# EAGLE board BonkSwitch (EAGLE 7.7.0)
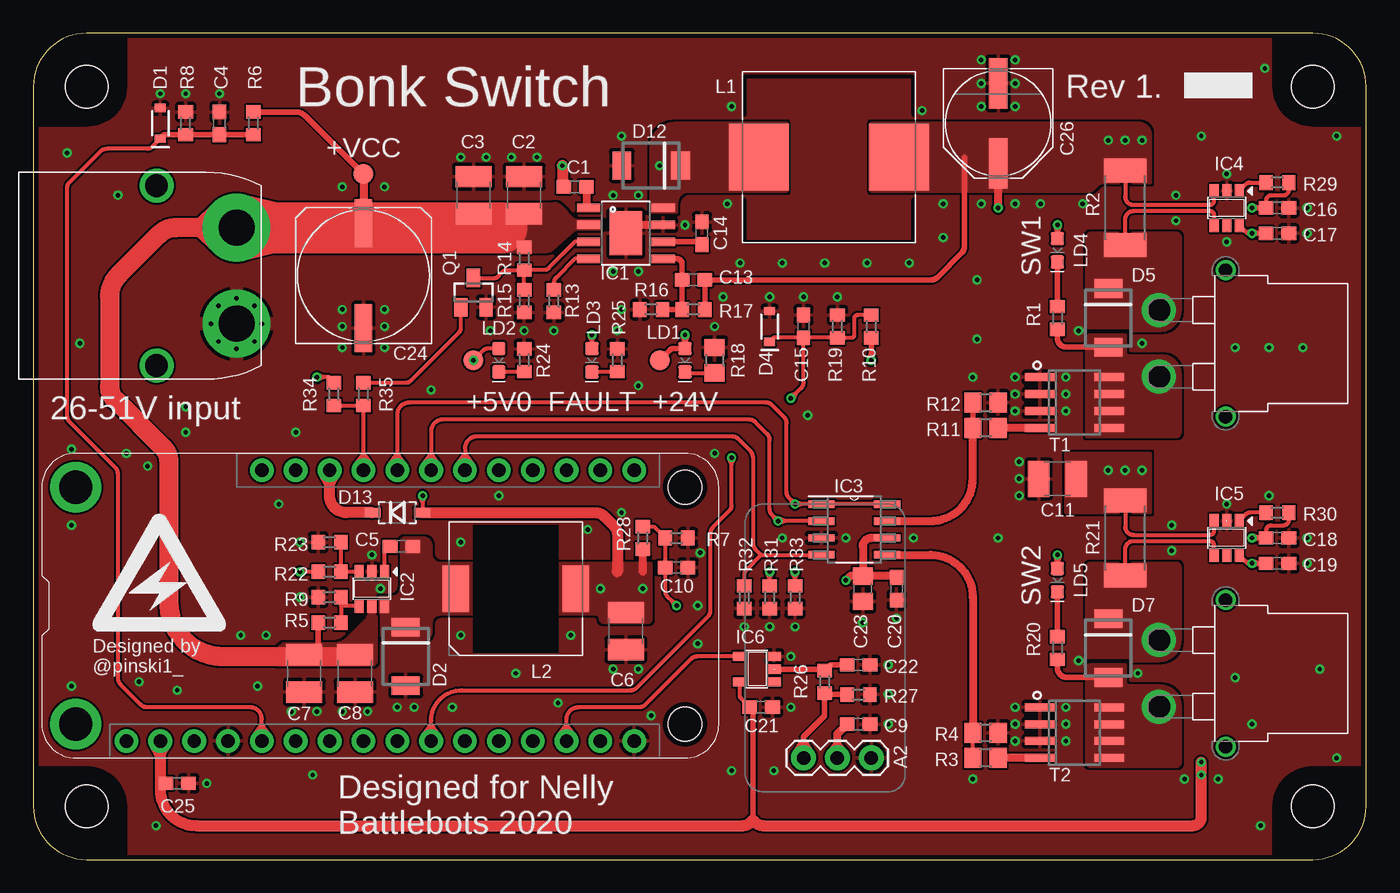
[diagram p1: board, top side]
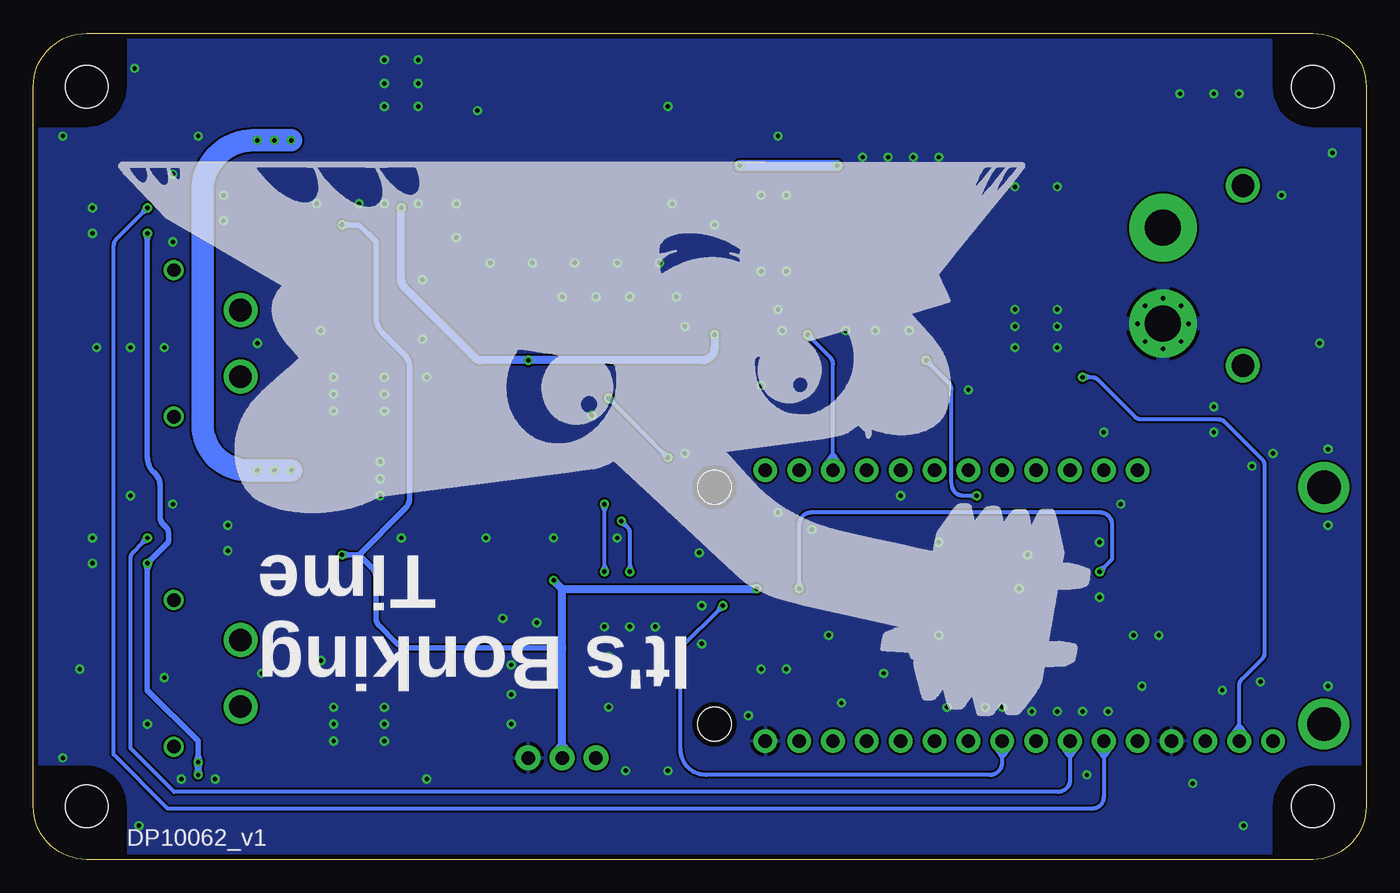
[diagram p2: board, bottom side, seen from below]

Size 100 x 62 mm. Coordinates in mm from the lower left corner, seen from the top.
Copper layers (1*16): Top 0.0356mm / dielectric 1.5011mm / Bottom 0.0356mm
Design rules "OSHPark-2layer": minimum track width 6mil, minimum drill 13mil, track to track 6mil, track to pad 6mil, pad to pad 6mil, via to via 6mil, smd to smd 6mil, copper to edge 15mil, drill to drill 6mil, minimum pad ring 7mil, minimum via ring 7mil, stop-mask expansion 3mil, vias tented up to drill 15mil, thermal gap 10mil
Net classes: 0 default: width 0.152 mm, drill 0.33 mm; 1 power: width 0.508 mm, drill 0.33 mm, clearance 0.305 mm
tRestrict: 6 lines

## Footprints (pad centres in the part's own frame; a part is rotated, then mirrored left to right if it is on the bottom)
FEATHERWING_DIM = drill 1 pad 1.778: 1 6.35,1.27; 2 8.89,1.27; 3 11.43,1.27; 4 13.97,1.27; 5 16.51,1.27; 6 19.05,1.27; 7 21.59,1.27; 8 24.13,1.27; 9 26.67,1.27; 10 29.21,1.27; 11 31.75,1.27; 12 34.29,1.27; 13 36.83,1.27; 14 39.37,1.27; 15 41.91,1.27; 16 44.45,1.27; 17 44.45,21.59; 18 41.91,21.59; 19 39.37,21.59; 20 36.83,21.59; 21 34.29,21.59; 22 31.75,21.59; 23 29.21,21.59; 24 26.67,21.59; 25 24.13,21.59; 26 21.59,21.59; 27 19.05,21.59; 28 16.51,21.59 | drill 2.5 pad 3.81: P$1 2.54,20.32; P$2 2.54,2.54 | hole 2.54: 48.26,20.32; 48.26,2.54
FRSKY_XM+ = drill 1.016 pad 1.88: 1 0,0; 2 0,2.54; 3 0,5.08
C0603 = smd 1.1 x 1: 1 -0.85,0; 2 0.85,0
C1210 = smd 1.6 x 2.7: 1 -1.4,0; 2 1.4,0
C0805 = smd 1.3 x 1.5: 1 -0.95,0; 2 0.95,0
UD-10X10_NICHICON = smd 3.6 x 1.3: + 3.925,0; - -3.95,0
PANASONIC_E = smd 3.8 x 1.4: + 3,0; - -3,0
SOD-323 = smd 0.63 x 0.83: A 1.15,0; C -1.15,0
SOD128 = smd 1.4 x 2.1: A 2.2,0; C -2.2,0
SOD-123 = smd 1.2 x 0.7: A 1.85,0; C -1.85,0
HSOIC8 = smd 0.65 x 1.75: 1 -1.905,-2.8; 2 -0.635,-2.8; 3 0.635,-2.8; 4 1.905,-2.8; 5 1.905,2.8; 6 0.635,2.8; 7 -0.635,2.8; 8 -1.905,2.8 | smd 3.3 x 2.41: EP 0,0
SOT23-6 = smd 0.69 x 0.99: 1 -0.95,-1.29; 2 0,-1.29; 3 0.95,-1.29; 4 0.95,1.3; 5 0,1.3; 6 -0.95,1.3
SOIC127P600X175-8N = smd 1.981 x 0.559: 1 -2.464,1.905; 2 -2.464,0.635; 3 -2.464,-0.635; 4 -2.464,-1.905; 5 2.464,-1.905; 6 2.464,-0.635; 7 2.464,0.635; 8 2.464,1.905
SOT23-5 = smd 0.69 x 0.99: 1 -0.95,-1.29; 2 0,-1.29; 3 0.95,-1.29; 4 0.95,1.3; 5 -0.95,1.3
WE-HCI_1350/1365 = smd 4.5 x 5: 1 -5.25,0; 2 5.25,0
WE-PD_1030/1050 = smd 2 x 3.5: 1 -4.5,0; 2 4.5,0
LED-0603 = smd 1 x 1: A -0.877,0; C 0.877,0
DP10062_V1 = hole 3.2: 4,4; 96,4; 96,58; 4,58
SOT23 = smd 1 x 1.4: 1 -0.95,-1.1; 2 0.95,-1.1; 3 0,1.1
R0603 = smd 1 x 1.1: 1 -0.85,0; 2 0.85,0
R2512 = smd 1.8 x 3.2: 1 -2.8,0; 2 2.8,0
R0805 = smd 1.3 x 1.5: 1 -0.95,0; 2 0.95,0
SHORT_TOP-01 = smd 0.025 x 0.025: 1 0,0; 2 0,0
SO-08 = smd 0.6 x 2.2: 1 -1.905,-2.6; 2 -0.635,-2.6; 3 0.635,-2.6; 4 1.905,-2.6; 5 1.905,2.6; 6 0.635,2.6; 7 -0.635,2.6; 8 -1.905,2.6
TESTPAD_1.5X1.5 = smd 1.5 x 1.5: 1 0,0
XT60PW-M = drill 1.7: 3 6.75,6; 4 -6.75,6 | drill 2.7 pad 5.08: + 3.6,0; - -3.6,0
XT30PW-F = drill 1.7: + -2.5,0; - 2.5,0 | drill 1: P$3 5.5,5; P$4 -5.5,5

## Placement (x,y rotation side)
A1  FEATHERWING_NODIM  [FEATHERWING_DIM]  0.64,7.62 0 top
A2  FRSKY_XM+  [FRSKY_XM+]  62.87,7.62 90 top
C1  100nF  [C0603]  40.64,50.48 180 top
C2  2.2uF 100V  [C1210]  36.83,49.85 90 top
C3  2.2uF 100V  [C1210]  33.02,49.85 90 top
C4  10nF  [C0603]  13.97,55.24 90 top
C5  100nF  [C0603]  27.62,23.5 0 top
C6  10uF 35V  [C1210]  44.45,17.14 270 top
C7  2.2uF 100V  [C1210]  20.32,13.97 270 top
C8  2.2uF 100V  [C1210]  24.13,13.97 270 top
C9  100nF  [C0603]  61.91,10.16 0 top
C10  10nF  [C0603]  48.26,21.91 0 top
C11  10uF 35V  [C1210]  76.83,28.57 180 top
C13  470pF  [C0603]  49.53,43.5 180 top
C14  10nF  [C0603]  50.16,46.99 90 top
C15  10nF  [C0603]  57.78,40.01 90 top
C16  100nF  [C0603]  93.34,48.9 0 top
C17  100nF  [C0603]  93.34,46.99 0 top
C18  100nF  [C0603]  93.34,24.13 0 top
C19  100nF  [C0603]  93.34,22.23 0 top
C20  100nF  [C0603]  64.77,20.32 270 top
C21  100nF  [C0603]  54.61,11.43 0 top
C22  100pF  [C0603]  61.91,14.61 0 top
C23  1uF  [C0805]  62.23,20.32 270 top
C24  47uF 100V  [UD-10X10_NICHICON]  24.77,43.81 90 top
C25  100nF  [C0603]  10.79,5.71 0 top
C26  120uF 35V  [PANASONIC_E]  72.39,55.24 270 top
D1  5.6V  [SOD-323]  9.53,55.24 90 top
D2  PMEG10030ELPX  [SOD128]  27.94,15.24 270 top
D4  5.6V  [SOD-323]  55.24,40.01 90 top
D5  PMEG10030ELPX  [SOD128]  80.64,40.64 270 top
D7  PMEG10030ELPX  [SOD128]  80.64,15.88 270 top
D12  PMEG10030ELPX  [SOD128]  46.35,52.07 180 top
D13  MBR130  [SOD-123]  27.3,26.04 0 top
IC1  LMR16030SDDAR  [HSOIC8]  44.45,46.99 270 top
IC2  LMR16006XDDC  [SOT23-6]  25.4,20.32 180 top
IC3  FAN3227TMX  [SOIC127P600X175-8N]  61.59,24.77 0 top
IC4  LMP8640MK-T  [SOT23-6]  89.53,48.9 180 top
IC5  LMP8640MK-T  [SOT23-6]  89.53,24.13 180 top
IC6  74LVC1G14DBV  [SOT23-5]  54.29,14.29 90 top
L1  7443551221  [WE-HCI_1350/1365]  59.69,52.7 0 top
L2  7447714470  [WE-PD_1030/1050]  36.2,20.32 0 top
LD1  GREEN  [LED-0603]  48.9,37.47 270 top
LD2  GREEN  [LED-0603]  34.92,37.47 270 top
LD3  RED  [LED-0603]  41.91,37.47 270 top
LD4  Yellow  [LED-0603]  76.83,45.72 270 top
LD5  Yellow  [LED-0603]  76.83,20.95 270 top
LG1  [LOGO_10X10]  4.45,17.14 0 top
PCB1  PCB_DP_RECTANGLE-100X62  [DP10062_V1]  0,0 0 top
Q1  SI2302CDS  [SOT23]  33.02,42.55 0 top
R1  2k2  [R0603]  76.83,40.64 90 top
R2  0R01  [R2512]  81.92,48.9 90 top
R3  10R  [R0805]  71.44,7.62 180 top
R4  39k  [R0805]  71.44,9.53 0 top
R5  82k  [R0603]  22.23,17.78 180 top
R6  470k  [R0603]  16.51,55.24 90 top
R7  33k  [R0603]  48.26,24.13 180 top
R8  30k  [R0603]  11.43,55.24 270 top
R9  4k3  [R0603]  22.23,19.68 0 top
R10  470k  [R0603]  62.87,40.01 270 top
R11  10R  [R0805]  71.44,32.38 180 top
R12  39k  [R0805]  71.44,34.29 0 top
R13  47k  [R0603]  39.05,41.91 90 top
R14  130k  [R0603]  36.83,45.09 90 top
R15  20k  [R0603]  36.83,41.91 90 top
R16  20k  [R0603]  46.35,41.27 0 top
R17  620k  [R0603]  49.53,41.27 0 top
R18  2k2  [R0805]  51.12,37.47 270 top
R19  56k  [R0603]  60.33,40.01 270 top
R20  2k2  [R0603]  76.83,15.88 90 top
R21  0R01  [R2512]  81.92,24.13 90 top
R22  68k  [R0603]  22.23,21.59 180 top
R23  11k  [R0603]  22.23,23.81 0 top
R24  2k2  [R0603]  36.83,37.47 270 top
R25  2k2  [R0603]  43.81,37.47 270 top
R26  100R  [R0603]  59.37,13.34 90 top
R27  10k  [R0603]  61.91,12.38 180 top
R28  47k  [R0603]  45.72,24.13 270 top
R29  100R  [R0603]  93.34,50.8 180 top
R30  100R  [R0603]  93.34,26.04 180 top
R31  10k  [R0603]  55.24,19.68 270 top
R32  10k  [R0603]  53.34,19.68 270 top
R33  10k  [R0603]  57.15,19.68 270 top
R34  10k  [R0603]  22.54,34.92 270 top
R35  100R  [R0603]  24.77,34.92 270 top
SH1  SHORTT1  [SHORT_TOP-01]  81.92,51.12 0 top
SH2  SHORTT1  [SHORT_TOP-01]  81.92,46.67 0 top
SH3  SHORTT1  [SHORT_TOP-01]  81.92,26.35 0 top
SH4  SHORTT1  [SHORT_TOP-01]  81.92,21.91 0 top
T1  IRF7493TRPBF  [SO-08]  78.11,34.29 270 top
T2  IRF7493TRPBF  [SO-08]  78.11,9.53 270 top
TP1  TESTPOINT_1.5X1.5  [TESTPAD_1.5X1.5]  46.99,37.47 0 top
TP2  TESTPOINT_1.5X1.5  [TESTPAD_1.5X1.5]  33.02,37.47 0 top
TP3  TESTPOINT_1.5X1.5  [TESTPAD_1.5X1.5]  24.77,51.44 0 top
X1  XT60PW-M  [XT60PW-M]  15.24,43.81 90 top
X2  XT30PW-F  [XT30PW-F]  84.45,38.73 270 top
X3  XT30PW-F  [XT30PW-F]  84.45,13.97 270 top

## Tracks (layer width: path | path; a pad name or v marks a point on that pad's centre or on a via)
5V_MON  (via drill 0.33)
  Top 0.305: R28.1 46.56,24.98 R7.2 C10.1 47.41,20.09 arc45 47.55,19.76 47.91,19.4 | 47.91,19.4 v48.26,19.05 | 47.91,19.4 48.08,18.98 v48.26,19.05 | 47.91,19.4 48.33,19.23 v48.26,19.05
  Bottom 0.305: A1.9 27.3,7.89 27.3,7.3 arc90 28.26,6.35 49.53,6.35 arc90 51.44,8.26 51.44,15.61 arc45 51.25,16.06 48.61,18.7 | 48.61,18.7 v48.26,19.05 | 48.61,18.7 48.44,19.12 v48.26,19.05 | 48.61,18.7 48.19,18.87 v48.26,19.05
  Bottom 0.61: 27.3,7.89 27.78,8.55 A1.9 26.83,8.55 27.3,7.89
24V_MON  (via drill 0.33)
  Top 0.305: A1.10 29.84,9.89 | 29.84,9.89 | 29.84,9.89 29.84,10.41 arc-90 32.13,12.7 44.82,12.7 arc45 45.27,12.89 50.61,18.23 arc45 50.8,18.68 50.8,24.39 arc-45 51.06,25.03 52.26,26.22 arc45 52.39,26.54 52.39,29.67 | 52.39,29.67 | 52.39,29.67 v52.39,30.16 | C15.1 R19.2 61.38,39.16 arc90 61.59,39.37 61.59,40.64 arc-90 61.81,40.85 R10.1 | C15.1 55.55,39.16 D4.C | v56.83,34.61 57.18,34.96 | 57.18,34.96 57.6,35.37 arc45 57.78,35.82 C15.1 | 52.39,29.67 52.56,30.09 | 52.39,29.67 52.21,30.09 | 52.56,30.09 | 52.21,30.09 | v52.39,30.16 52.21,30.09 | 52.39,29.67 52.56,30.09 | 52.39,29.67 | 52.39,29.67 52.21,30.09 | 52.39,29.67 52.56,30.09 | v52.39,30.16 52.56,30.09 | 52.39,29.67 52.21,30.09 | v52.39,30.16 52.21,30.09 | 52.39,29.67 52.56,30.09 | v52.39,30.16 52.56,30.09 | 52.39,29.67 52.21,30.09 | v52.39,30.16 52.21,30.09 | 57.18,34.96 56.76,34.78 v56.83,34.61 | 57.18,34.96 57.01,34.53 v56.83,34.61
  Top 0.61: 29.84,9.89 | 29.84,9.89 29.37,9.23 | 29.84,9.89 29.37,9.23 | 29.84,9.89 30.32,9.23 | A1.10 30.32,9.23 | 29.84,9.89 29.37,9.23 | A1.10 29.37,9.23 | 29.84,9.89 30.32,9.23 | 29.84,9.89 29.37,9.23 | A1.10 29.37,9.23 | 29.84,9.89 30.32,9.23 | A1.10 30.32,9.23 | 29.84,9.89 29.37,9.23 | A1.10 29.37,9.23 | 29.84,9.89 30.32,9.23 | A1.10 30.32,9.23
  Bottom 0.305: v52.39,30.16 52.74,30.51 | 52.74,30.51 56.48,34.26 | 56.48,34.26 v56.83,34.61 | 52.74,30.51 52.31,30.34 v52.39,30.16 | 52.74,30.51 52.56,30.09 v52.39,30.16 | 56.48,34.26 56.91,34.43 v56.83,34.61 | 56.48,34.26 56.66,34.68 v56.83,34.61
!SBUS
  Top 0.406: R27.2 59.48,12.38 R26.1 59.37,10.79 57.78,9.21 57.78,8.64 A2.3
  Top 0.813: 57.78,8.64 57.33,7.9 A2.3 58.24,7.9 57.78,8.64
!SBUS_FILT
  Top 0.406: C22.1 59.79,14.61 R26.2 59.27,14.29 IC6.2
+3V3  (via drill 0.33)
  Top 0.305: v91.44,22.23 91.09,22.23 90.96,22.35 | v91.44,22.23 91.94,22.23 | 91.94,22.23 | 91.94,22.23 C19.1 | 90.96,22.35 IC5.6 | v91.44,46.99 91.09,46.99 90.96,47.12 | v91.44,46.99 91.94,46.99 | 91.94,46.99 | 91.94,46.99 C17.1 | IC4.6 90.96,47.12 | R34.1 22.23,36.2 21.77,36.2 | 21.77,36.2 | 21.77,36.2 v21.27,36.2 | IC6.5 52.99,12.35 arc45 53.1,12.09 C21.1 | 21.77,36.2 21.35,36.37 | 21.77,36.2 21.35,36.02 | 21.35,36.37 | 21.35,36.02 | v21.27,36.2 21.35,36.02 | 91.94,46.99 91.51,47.17 | 91.94,46.99 91.51,46.81 | 91.51,47.17 | 91.51,46.81 | v91.44,46.99 91.51,46.81 | 91.94,22.23 91.51,22.4 | 91.94,22.23 91.51,22.05 | 91.51,22.4 | 91.51,22.05 | v91.44,22.23 91.51,22.05 | 21.77,36.2 21.35,36.37 | 21.77,36.2 | 21.77,36.2 21.35,36.02 | 21.77,36.2 21.35,36.37 | v21.27,36.2 21.35,36.37 | 21.77,36.2 21.35,36.02 | v21.27,36.2 21.35,36.02 | 21.77,36.2 21.35,36.37 | v21.27,36.2 21.35,36.37 | 21.77,36.2 21.35,36.02 | v21.27,36.2 21.35,36.02 | 91.94,46.99 91.51,47.17 | 91.94,46.99 | 91.94,46.99 91.51,46.81 | 91.94,46.99 91.51,47.17 | v91.44,46.99 91.51,47.17 | 91.94,46.99 91.51,46.81 | v91.44,46.99 91.51,46.81 | 91.94,46.99 91.51,47.17 | v91.44,46.99 91.51,47.17 | 91.94,46.99 91.51,46.81 | v91.44,46.99 91.51,46.81 | 90.96,47.12 91.32,46.84 v91.44,46.99 | 90.96,47.12 91.42,47.18 v91.44,46.99 | 91.94,22.23 91.51,22.4 | 91.94,22.23 | 91.94,22.23 91.51,22.05 | 91.94,22.23 91.51,22.4 | v91.44,22.23 91.51,22.4 | 91.94,22.23 91.51,22.05 | v91.44,22.23 91.51,22.05 | 91.94,22.23 91.51,22.4 | v91.44,22.23 91.51,22.4 | 91.94,22.23 91.51,22.05 | v91.44,22.23 91.51,22.05 | 90.96,22.35 91.32,22.07 v91.44,22.23 | 90.96,22.35 91.42,22.41 v91.44,22.23
  Top 0.406: C21.1 53.98,11.43 53.98,2.97
  Top 0.813: A1.2 9.53,7.89 | 9.53,7.89 9.53,5.71 | 9.53,5.71 9.53,5.23 arc90 12.22,2.54 53.27,2.54 arc45 53.74,2.73 53.98,2.97 54.16,2.79 arc45 54.75,2.54 87,2.54 arc90 87.63,3.17 v87.63,6.35 v87.63,7.3 | C25.1 9.53,5.71 | 9.53,7.89 9.95,8.66 A1.2 | 9.53,7.89 9.1,8.66 A1.2
  Bottom 0.305: A1.2 9.53,9.89 | 9.53,9.89 | 9.53,9.89 9.53,13.07 arc45 9.34,13.52 7.81,15.05 arc-45 7.62,15.5 7.62,29.58 arc-45 7.81,30.03 10.61,32.83 arc-45 11.06,33.02 16.88,33.02 arc45 17.33,33.21 20.13,36.01 arc-45 20.58,36.2 20.78,36.2 | v21.27,36.2 20.78,36.2 | 20.78,36.2 | 20.78,36.2 21.2,36.02 | 21.2,36.02 | v21.27,36.2 21.2,36.02 | 20.78,36.2 21.2,36.37 | 20.78,36.2 21.2,36.02 | 20.78,36.2 | 20.78,36.2 21.2,36.02 | v21.27,36.2 21.2,36.02 | 20.78,36.2 21.2,36.37 | 21.2,36.37 | v21.27,36.2 21.2,36.37 | 20.78,36.2 21.2,36.02 | 20.78,36.2 21.2,36.37 | 20.78,36.2 21.2,36.02 | v21.27,36.2 21.2,36.02 | 20.78,36.2 21.2,36.37 | v21.27,36.2 21.2,36.37
  Bottom 0.406: 91.44,46.49 91.44,30.18 arc-45 90.97,29.06 90.87,28.96 arc45 90.49,28.03 90.49,25.69 arc-45 90.28,25.19 90.06,24.97 arc45 89.85,24.47 89.85,24 arc45 89.98,23.68 91.09,22.57 | 91.44,46.49 | 91.44,46.49 v91.44,46.99 | 91.09,22.57 v91.44,22.23 | v91.44,22.23 91.44,21.73 | 91.44,21.73 | 91.44,21.73 91.44,12.7 87.63,8.89 87.63,7.8 | 87.63,7.8 | 87.63,7.8 v87.63,7.3 | v87.63,7.3 87.63,6.84 | 87.63,6.84 | 87.63,6.84 87.63,6.81 | 87.63,6.81 | 87.63,6.81 v87.63,6.35 | 91.44,46.49 91.57,46.95 | 91.44,46.49 91.57,46.95 | 91.57,46.95 | 91.57,46.95 | 91.44,46.49 91.31,46.95 | 91.31,46.95 | v91.44,46.99 91.31,46.95 | 91.57,46.95 | v91.44,46.99 91.57,46.95 | 91.31,46.95 | 91.44,21.73 91.57,22.19 | 91.44,21.73 91.57,22.19 | 91.57,22.19 | 91.57,22.19 | 91.44,21.73 91.31,22.19 | 91.31,22.19 | v91.44,22.23 91.31,22.19 | 91.57,22.19 | v91.44,22.23 91.57,22.19 | 91.31,22.19 | 87.63,7.8 87.76,7.34 | 87.63,6.81 87.64,6.84 | 87.5,7.34 | 87.76,7.34 | v87.63,7.3 87.76,7.34 | 87.63,7.8 87.5,7.34 | 87.5,7.34 | v87.63,7.3 87.5,7.34 | 87.63,7.8 87.76,7.34 | 87.76,7.34 | v87.63,7.3 87.76,7.34 | 87.63,6.81 87.76,7.26 | 87.76,7.26 | 87.76,7.26 | 87.63,6.81 87.62,6.84 | 87.5,7.26 | v87.63,7.3 87.5,7.26 | 87.76,7.26 | v87.63,7.3 87.76,7.26 | 87.5,7.26 | 87.64,6.84 87.65,6.81 | 87.65,6.81 87.77,6.39 | 87.62,6.84 87.61,6.81 | 87.61,6.81 87.5,6.39 | 87.62,6.84 87.63,6.81 | 87.63,6.81 87.76,6.39 | 87.63,6.84 87.62,6.81 | 87.62,6.81 87.5,6.39 | 87.5,6.39 | 87.5,6.39 | 87.63,6.84 87.64,6.81 | 87.64,6.81 87.76,6.39 | 87.76,6.39 | v87.63,6.35 87.76,6.39 | 87.63,6.84 87.62,6.81 | 87.62,6.81 87.5,6.39 | 87.5,6.39 | v87.63,6.35 87.5,6.39 | 87.63,6.84 87.64,6.81 | 87.64,6.81 87.76,6.39 | 87.76,6.39 | v87.63,6.35 87.76,6.39 | 91.44,46.49 91.57,46.95
  Bottom 0.406: 91.44,46.49 | 91.44,46.49 91.31,46.95 | 91.31,46.95 | 91.44,46.49 91.57,46.95 | 91.57,46.95 | 91.44,46.49 91.31,46.95 | v91.44,46.99 91.31,46.95 | 91.44,46.49 91.57,46.95 | v91.44,46.99 91.57,46.95 | 91.44,46.49 91.31,46.95 | v91.44,46.99 91.31,46.95 | 91.44,21.73 91.57,22.19 | 91.09,22.57 91.32,22.16 v91.44,22.23 | 91.09,22.57 91.51,22.35 v91.44,22.23 | 91.44,21.73 | 91.44,21.73 91.31,22.19 | 91.31,22.19 | 91.44,21.73 91.57,22.19 | 91.57,22.19 | 91.44,21.73 91.31,22.19 | v91.44,22.23 91.31,22.19 | 91.44,21.73 91.57,22.19 | v91.44,22.23 91.57,22.19 | 91.44,21.73 91.31,22.19 | v91.44,22.23 91.31,22.19 | 87.63,7.8 87.76,7.34 | 87.63,6.81 87.76,7.26 | 87.5,7.34 | 87.63,7.8 | 87.63,7.8 87.5,7.34 | 87.5,7.34 | v87.63,7.3 87.5,7.34 | 87.63,7.8 87.76,7.34 | 87.63,7.8 87.5,7.34 | v87.63,7.3 87.5,7.34 | 87.63,7.8 87.76,7.34 | 87.76,7.34 | 87.63,7.8 87.5,7.34 | v87.63,7.3 87.5,7.34 | 87.63,7.8 87.76,7.34 | v87.63,7.3 87.76,7.34 | 87.63,6.81 | 87.5,7.26 | 87.5,7.26 | 87.63,6.81 87.76,7.26 | 87.76,7.26 | 87.76,7.26 | 87.63,6.81 87.62,6.84 | 87.62,6.84 87.5,7.26 | v87.63,7.3 87.5,7.26 | 87.63,6.81 87.64,6.84 | 87.64,6.84 87.76,7.26 | v87.63,7.3 87.76,7.26 | 87.63,6.81 87.62,6.84 | 87.62,6.84 87.5,7.26 | 87.5,7.26 | v87.63,7.3 87.5,7.26 | 87.76,7.26 87.63,6.81 87.5,7.26 | v87.63,7.3 87.76,7.26 | v87.63,7.3 87.5,7.26 | 87.65,6.81 87.77,7.27 v87.63,7.3 | 87.65,6.81 87.5,7.26 v87.63,7.3 | 87.61,6.81 87.76,7.26 v87.63,7.3 | 87.61,6.81 87.49,7.27 v87.63,7.3 | 87.63,6.81 87.76,7.26 | v87.63,7.3 87.76,7.26 | 87.63,6.81 87.5,7.26 | v87.63,7.3 87.5,7.26 | 87.62,6.81 87.76,7.26 | 87.62,6.81 87.61,6.84 | 87.5,7.27 | v87.63,7.3 87.5,7.27 | 87.64,6.81 87.65,6.84 | 87.64,6.81 87.63,6.84 | 87.63,6.84 87.5,7.26 | 87.62,6.81 87.63,6.84
  Bottom 0.406: 87.63,6.84 87.76,7.26 | v87.63,7.3 87.76,7.26 | 87.62,6.81 87.61,6.84 | 87.61,6.84 87.5,7.27 | v87.63,7.3 87.5,7.27 | 87.64,6.81 87.65,6.84 | 87.65,6.84 87.77,7.27 v87.63,7.3 | 87.64,6.81 87.5,7.26 | v87.63,7.3 87.5,7.26 | 87.63,6.84 87.76,6.39 | 87.63,6.84 87.76,6.39 | 87.62,6.84 87.5,6.39 | 87.5,6.39 | v87.63,6.35 87.5,6.39 | 87.62,6.84 87.76,6.39 | 87.63,6.84 87.5,6.39 | v87.63,6.35 87.5,6.39 | 87.63,6.84 87.76,6.39 | 87.76,6.39 | 87.76,6.39 | v87.63,6.35 87.76,6.39 | 87.61,6.84 87.49,6.38 v87.63,6.35 | 87.61,6.84 87.76,6.39 v87.63,6.35 | 87.65,6.84 87.5,6.39 v87.63,6.35 | 87.65,6.84 87.77,6.38 v87.63,6.35 | 87.63,6.84 87.5,6.39 | 87.5,6.39 | v87.63,6.35 87.5,6.39 | 87.63,6.84 87.76,6.39 | v87.63,6.35 87.76,6.39 | 87.5,6.39 | 87.63,6.84 | 87.64,6.84 87.5,6.39 v87.63,6.35 | 87.64,6.84 87.77,6.39 | v87.63,6.35 87.77,6.39 | 87.62,6.84 87.5,6.39 | v87.63,6.35 87.5,6.39 | 87.62,6.84 87.76,6.39 | v87.63,6.35 87.76,6.39 | 87.63,6.84 87.5,6.39 | 87.5,6.39 | v87.63,6.35 87.5,6.39 | 87.63,6.84 87.76,6.39 | 87.63,6.84 87.5,6.39 | v87.63,6.35 87.5,6.39 | 87.63,6.84 87.76,6.39 | 87.76,6.39 | 87.63,6.84 87.5,6.39 | v87.63,6.35 87.5,6.39 | 87.63,6.84 87.76,6.39 | v87.63,6.35 87.76,6.39
  Bottom 0.61: 9.53,9.89 | 9.53,9.89 9.05,9.23 | 9.53,9.89 9.05,9.23 | 9.53,9.89 10,9.23 | A1.2 10,9.23 | 9.53,9.89 9.05,9.23 | A1.2 9.05,9.23 | 9.53,9.89 10,9.23 | 9.53,9.89 9.05,9.23 | A1.2 9.05,9.23 | 9.53,9.89 10,9.23 | A1.2 10,9.23 | 9.53,9.89 9.05,9.23 | A1.2 9.05,9.23 | 9.53,9.89 10,9.23 | A1.2 10,9.23
+5V  (via drill 0.33)
  Top 0.305: R22.2 20.5,21.59 | 20.5,21.59 | 20.5,21.59 v20,21.59 | v29.21,27.3 29.21,26.81 | 29.21,26.81 | 29.21,26.81 29.21,26.09 D13.A | LD2.A 34.04,38.34 arc45 33.8,38.24 33.37,37.81 | 33.37,37.81 TP2.1 | 20.5,21.59 20.08,21.77 | 20.5,21.59 20.08,21.41 | 20.08,21.77 | 20.08,21.41 | v20,21.59 20.08,21.41 | 29.21,26.81 29.39,27.23 | 29.21,26.81 29.03,27.23 | 29.39,27.23 | 29.03,27.23 | v29.21,27.3 29.03,27.23 | 20.5,21.59 20.08,21.77 | 20.5,21.59 | 20.5,21.59 20.08,21.41 | 20.5,21.59 20.08,21.77 | v20,21.59 20.08,21.77 | 20.5,21.59 20.08,21.41 | v20,21.59 20.08,21.41 | 20.5,21.59 20.08,21.77 | v20,21.59 20.08,21.77 | 20.5,21.59 20.08,21.41 | v20,21.59 20.08,21.41 | 29.21,26.81 29.39,27.23 | 29.21,26.81 | 29.21,26.81 29.03,27.23 | 29.21,26.81 29.39,27.23 | v29.21,27.3 29.39,27.23 | 29.21,26.81 29.03,27.23 | v29.21,27.3 29.03,27.23 | 29.21,26.81 29.39,27.23 | v29.21,27.3 29.39,27.23 | 29.21,26.81 29.03,27.23 | v29.21,27.3 29.03,27.23 | 33.37,37.81 32.95,37.64 TP2.1 | 33.37,37.81 33.2,37.39 TP2.1
  Top 0.406: LD5.A 76.83,22.36 | 76.83,22.36 v76.83,22.86 | LD4.A 76.83,47.13 | 76.83,47.13 v76.83,47.62 | 76.83,22.36 76.97,22.82 | v76.83,22.86 76.97,22.82 | 76.83,22.36 76.7,22.82 | v76.83,22.86 76.7,22.82 | 76.83,22.36 76.97,22.82 | 76.97,22.82 | 76.83,22.36 76.7,22.82 | v76.83,22.86 76.7,22.82 | 76.83,22.36 76.97,22.82 | v76.83,22.86 76.97,22.82 | 76.83,22.36 76.7,22.82 | v76.83,22.86 76.7,22.82 | 76.83,47.13 76.97,47.59 | v76.83,47.62 76.97,47.59 | 76.83,47.13 76.7,47.59 | v76.83,47.62 76.7,47.59 | 76.83,47.13 76.97,47.59 | 76.97,47.59 | 76.83,47.13 76.7,47.59 | v76.83,47.62 76.7,47.59 | 76.83,47.13 76.97,47.59 | v76.83,47.62 76.97,47.59 | 76.83,47.13 76.7,47.59 | v76.83,47.62 76.7,47.59
  Top 0.61: C23.1 61.27,21.27 v60.96,20.95 | IC3.6 62.87,24.13 arc90 62.23,23.5 C23.1 | C20.1 64.67,21.27 C23.1 | A2.2 60.33,8.64 | 60.33,8.64 | 60.33,8.64 60.33,9.42 C9.1 | 60.33,8.64 60.82,8.02 | 60.82,8.02 | R28.2 45.72,21.59 | 60.33,8.64 | 60.33,8.64 59.83,8.02 | 59.83,8.02 | 60.33,8.64 59.83,8.02 | A2.2 59.83,8.02 | 60.33,8.64 60.82,8.02 | 60.82,8.02 | A2.2 60.82,8.02 | 60.33,8.64 59.83,8.02 | 59.83,8.02 | 59.83,8.02 | A2.2 59.83,8.02 | 60.33,8.64 60.82,8.02 | A2.2 60.82,8.02 | 60.33,8.64 59.83,8.02 | A2.2 59.83,8.02 | 60.33,8.64 60.82,8.02 | 60.82,8.02 | A2.2 60.82,8.02 | 60.33,8.64 59.83,8.02 | A2.2 59.83,8.02 | 60.33,8.64 60.82,8.02 | A2.2 60.82,8.02
  Top 0.813: D13.A 42.17,26.04 arc-45 42.81,25.77 43.63,24.95 arc-45 43.81,24.5 43.81,21.59
  Bottom 0.305: v20,21.59 19.65,21.94 | 19.65,21.94 19.14,22.45 arc-45 19.05,22.67 19.05,25.14 arc-90 19.95,26.04 41.65,26.04 arc-90 42.55,25.14 42.55,20.82 | 42.55,20.82 | 42.55,20.82 v42.55,20.32 | 32.67,37.12 31.3,35.75 arc45 31.11,35.3 31.11,28.2 arc-90 30.22,27.3 29.7,27.3 | 32.67,37.12 TP2.1 | 29.7,27.3 | 29.7,27.3 v29.21,27.3 | 42.55,20.82 42.37,20.39 | 42.37,20.39 | v42.55,20.32 42.37,20.39 | 42.55,20.82 42.72,20.39 | 29.7,27.3 29.28,27.48 | 29.7,27.3 29.28,27.13 | 29.28,27.48 | 29.28,27.13 | v29.21,27.3 29.28,27.13 | 19.65,21.94 19.83,21.52 v20,21.59 | 19.65,21.94 20.07,21.77 v20,21.59 | 42.55,20.82 42.37,20.39 | 42.55,20.82 | 42.55,20.82 42.37,20.39 | v42.55,20.32 42.37,20.39 | 42.55,20.82 42.72,20.39 | 42.72,20.39 | v42.55,20.32 42.72,20.39 | 42.55,20.82 42.37,20.39 | 42.55,20.82 42.72,20.39 | 42.55,20.82 42.37,20.39 | v42.55,20.32 42.37,20.39 | 42.55,20.82 42.72,20.39 | v42.55,20.32 42.72,20.39 | 29.7,27.3 29.28,27.48 | 29.7,27.3 | 29.7,27.3 29.28,27.13 | 29.7,27.3 29.28,27.48 | v29.21,27.3 29.28,27.48 | 29.7,27.3 29.28,27.13 | v29.21,27.3 29.28,27.13 | 29.7,27.3 29.28,27.48 | v29.21,27.3 29.28,27.48 | 29.7,27.3 29.28,27.13 | v29.21,27.3 29.28,27.13 | 32.67,37.12 33.09,37.29 TP2.1 | 32.67,37.12 32.84,37.54 TP2.1
  Bottom 0.406: 60.33,15.88 71.8,15.88 arc45 72.81,16.29 74.03,17.52 arc45 74.3,18.15 74.3,21.22 arc-45 74.56,21.85 75.56,22.86 | v76.83,22.86 76.34,22.86 | 76.34,22.86 75.56,22.86 | v76.83,47.62 76.34,47.62 | 76.34,47.62 75.56,47.62 74.3,46.35 74.3,40.75 arc-45 73.77,39.48 72.17,37.88 arc45 71.75,36.88 71.75,27.2 arc45 72.13,26.3 75.56,22.86 | 76.34,22.86 76.8,22.73 | v76.83,22.86 76.8,22.73 | 76.34,22.86 76.8,22.99 | v76.83,22.86 76.8,22.99 | 76.34,22.86 76.8,22.73 | 76.8,22.73 | 76.34,22.86 76.8,22.99 | v76.83,22.86 76.8,22.99 | 76.34,22.86 76.8,22.73 | v76.83,22.86 76.8,22.73 | 76.34,22.86 76.8,22.99 | v76.83,22.86 76.8,22.99 | 76.34,47.62 76.8,47.49 | v76.83,47.62 76.8,47.49 | 76.34,47.62 76.8,47.76 | v76.83,47.62 76.8,47.76 | 76.34,47.62 76.8,47.49 | 76.8,47.49 | 76.34,47.62 76.8,47.76 | v76.83,47.62 76.8,47.76 | 76.34,47.62 76.8,47.49 | v76.83,47.62 76.8,47.49 | 76.34,47.62 76.8,47.76 | v76.83,47.62 76.8,47.76
  Bottom 0.61: v60.96,20.95 60.33,20.32 | 60.33,20.32 v45.72,20.32 | A2.2 60.33,8.64 | 60.33,8.64 | 60.33,8.64 60.33,15.88 60.33,20.32 | 60.33,8.64 60.82,8.02 | 60.82,8.02 | 60.33,8.64 | 60.33,8.64 59.83,8.02 | 59.83,8.02 | 60.33,8.64 59.83,8.02 | A2.2 59.83,8.02 | 60.33,8.64 60.82,8.02 | 60.82,8.02 | A2.2 60.82,8.02 | 60.33,8.64 59.83,8.02 | 59.83,8.02 | 59.83,8.02 | A2.2 59.83,8.02 | 60.33,8.64 60.82,8.02 | A2.2 60.82,8.02 | 60.33,8.64 59.83,8.02 | A2.2 59.83,8.02 | 60.33,8.64 60.82,8.02 | 60.82,8.02 | A2.2 60.82,8.02 | 60.33,8.64 59.83,8.02 | A2.2 59.83,8.02 | 60.33,8.64 60.82,8.02 | A2.2 60.82,8.02
  other vias: 33.02,37.47
  pour Top (no thermals): 39.37,22.23 39.37,18.41 42.23,18.41 arc-90 42.55,18.1 arc90 42.86,17.78 46.04,17.78 arc90 46.35,18.1 46.35,22.23
+24V  (via drill 0.33)
  Top 0.406: R17.2 C13.1 67.36,43.5 arc45 67.81,43.68 69.66,45.53 arc45 69.85,45.98 69.85,52.7 | 48.9,38.88 LD1.A 48.01,38.34 arc45 47.77,38.24 TP1.1 | 48.9,38.88 | 48.9,38.88 v48.9,39.37 | R10.2 62.87,37.96 | 62.87,37.96 | 62.87,37.96 v62.87,37.47 | SH1.1 R2.2 | SH3.1 R21.2 | 48.9,38.88 49.03,39.33 | 48.9,38.88 49.03,39.33 | 49.03,39.33 | 49.03,39.33 | 48.9,38.88 48.76,39.33 | 48.76,39.33 | v48.9,39.37 48.76,39.33 | 49.03,39.33 | v48.9,39.37 49.03,39.33 | 48.76,39.33 | 62.87,37.96 63,37.5 | 62.73,37.5 | 63,37.5 | v62.87,37.47 63,37.5 | 62.87,37.96 62.73,37.5 | 62.73,37.5 | v62.87,37.47 62.73,37.5 | 62.87,37.96 63,37.5 | 63,37.5 | v62.87,37.47 63,37.5 | 48.9,38.88 49.03,39.33 | 48.9,38.88 | 48.9,38.88 48.76,39.33 | 48.76,39.33 | 48.9,38.88 49.03,39.33 | 49.03,39.33 | 48.9,38.88 48.76,39.33 | v48.9,39.37 48.76,39.33 | 48.9,38.88 49.03,39.33 | v48.9,39.37 49.03,39.33 | 48.9,38.88 48.76,39.33 | v48.9,39.37 48.76,39.33 | 62.87,37.96 63,37.5 | 62.73,37.5 | 62.87,37.96 | 62.87,37.96 62.73,37.5 | 62.73,37.5 | v62.87,37.47 62.73,37.5 | 62.87,37.96 63,37.5 | 62.87,37.96 62.73,37.5 | v62.87,37.47 62.73,37.5 | 62.87,37.96 63,37.5 | 63,37.5 | 62.87,37.96 62.73,37.5 | v62.87,37.47 62.73,37.5 | 62.87,37.96 63,37.5 | v62.87,37.47 63,37.5
  Top 0.61: v72.39,48.9 72.39,50.8
  Bottom 0.61: v72.39,48.9 72.39,43.44 arc-45 72.2,42.99 66.86,37.65 arc-45 66.41,37.47 v62.87,37.47 49.79,37.47 arc-90 48.9,38.36 v48.9,39.37
  Bottom 1.676: v80.64,53.98 v81.92,53.98 v83.19,53.98 83.49,53.98 arc-90 87.31,50.15 87.31,32.64 arc-90 83.88,29.21 v83.19,29.21 v81.92,29.21 v80.64,29.21
  pour Top (no thermals): 83.82,50.8 83.82,54.35 arc90 82.92,55.24 62.87,55.24 62.87,50.16 79.11,50.16 arc45 79.56,50.35 79.82,50.61 arc-45 80.27,50.8
  pour Top (no thermals): 77.47,30.48 83.82,30.48 83.82,26.04 77.47,26.04
BST_5V
  Top 0.305: IC2.1 26.35,23.5 C5.1
BST_24V
  Top 0.61: C1.1 41.49,48.9 IC1.1
EN_5V
  Top 0.305: R9.2 23.07,19.05 | 23.07,19.05 R5.1 | IC2.4 24.42,19.05 23.07,19.05
EN_24V
  Top 0.305: IC1.3 40.64,46.35 38.66,44.37 arc-45 38.33,44.23 R14.1 | R15.2 R14.1 | Q1.3 34.66,43.65 arc45 34.83,43.72 35.26,44.15 arc-45 35.47,44.23 R14.1
EN_PSU
  Top 0.305: A1.25 24.77,30.21 | 24.77,30.21 | 24.77,30.21 R35.2 R34.2
  Top 0.61: 24.77,30.21 | 24.77,30.21 24.29,29.55 | 24.77,30.21 24.29,29.55 | 24.77,30.21 25.24,29.55 | A1.25 25.24,29.55 | 24.77,30.21 24.29,29.55 | A1.25 24.29,29.55 | 24.77,30.21 25.24,29.55 | 24.77,30.21 24.29,29.55 | A1.25 24.29,29.55 | 24.77,30.21 25.24,29.55 | A1.25 25.24,29.55 | 24.77,30.21 24.29,29.55 | A1.25 24.29,29.55 | 24.77,30.21 25.24,29.55 | A1.25 25.24,29.55
EN_SW  (via drill 0.33)
  Top 0.305: IC3.8 IC3.1 57.65,26.67 | 27.3,30.21 27.3,33.39 arc-90 28.2,34.29 54.98,34.29 arc-45 55.43,34.1 56.33,33.21 arc-45 56.52,32.76 56.52,27.57 arc45 56.7,27.12 56.8,27.02 | 27.3,30.21 | 27.3,30.21 A1.24 | 57.65,26.67 | 57.65,26.67 v57.15,26.67 | v57.15,26.67 56.8,27.02 | R33.1 57.15,21.09 | 57.15,21.09 | 57.15,21.09 v57.15,21.59 | 57.15,21.09 57.33,21.52 | 57.15,21.09 56.97,21.52 | 57.33,21.52 | 56.97,21.52 | v57.15,21.59 56.97,21.52 | 57.65,26.67 57.22,26.85 | 57.65,26.67 57.22,26.49 | 57.22,26.85 | 57.22,26.49 | v57.15,26.67 57.22,26.49 | 57.15,21.09 57.33,21.52 | 57.15,21.09 | 57.15,21.09 56.97,21.52 | 57.15,21.09 57.33,21.52 | v57.15,21.59 57.33,21.52 | 57.15,21.09 56.97,21.52 | v57.15,21.59 56.97,21.52 | 57.15,21.09 57.33,21.52 | v57.15,21.59 57.33,21.52 | 57.15,21.09 56.97,21.52 | v57.15,21.59 56.97,21.52 | 57.65,26.67 57.22,26.85 | 57.65,26.67 | 57.65,26.67 57.22,26.49 | 57.65,26.67 57.22,26.85 | v57.15,26.67 57.22,26.85 | 57.65,26.67 57.22,26.49 | v57.15,26.67 57.22,26.49 | 57.65,26.67 57.22,26.85 | v57.15,26.67 57.22,26.85 | 57.65,26.67 57.22,26.49 | v57.15,26.67 57.22,26.49 | 56.8,27.02 56.97,26.6 v57.15,26.67 | 56.8,27.02 57.22,26.85 | v57.15,26.67 57.22,26.85
  Top 0.61: 27.3,30.21 | 27.3,30.21 26.83,29.55 | 27.3,30.21 26.83,29.55 | 27.3,30.21 27.78,29.55 | A1.24 27.78,29.55 | 27.3,30.21 26.83,29.55 | A1.24 26.83,29.55 | 27.3,30.21 27.78,29.55 | 27.3,30.21 26.83,29.55 | A1.24 26.83,29.55 | 27.3,30.21 27.78,29.55 | A1.24 27.78,29.55 | 27.3,30.21 26.83,29.55 | A1.24 26.83,29.55 | 27.3,30.21 27.78,29.55 | A1.24 27.78,29.55
  Bottom 0.305: v57.15,21.59 57.15,22.09 | 57.15,22.09 | 57.15,22.09 57.15,26.18 | 57.15,26.18 | 57.15,26.18 v57.15,26.67 | 57.15,22.09 56.97,21.66 | 56.97,21.66 | v57.15,21.59 56.97,21.66 | 57.15,22.09 57.33,21.66 | 57.15,26.18 57.33,26.6 | 57.15,26.18 56.97,26.6 | 57.33,26.6 | 56.97,26.6 | v57.15,26.67 56.97,26.6 | 57.15,22.09 56.97,21.66 | 57.15,22.09 | 57.15,22.09 56.97,21.66 | v57.15,21.59 56.97,21.66 | 57.15,22.09 57.33,21.66 | 57.33,21.66 | v57.15,21.59 57.33,21.66 | 57.15,22.09 56.97,21.66 | 57.15,22.09 57.33,21.66 | 57.15,22.09 56.97,21.66 | v57.15,21.59 56.97,21.66 | 57.15,22.09 57.33,21.66 | v57.15,21.59 57.33,21.66 | 57.15,26.18 57.33,26.6 | 57.15,26.18 | 57.15,26.18 56.97,26.6 | 57.15,26.18 57.33,26.6 | v57.15,26.67 57.33,26.6 | 57.15,26.18 56.97,26.6 | v57.15,26.67 56.97,26.6 | 57.15,26.18 57.33,26.6 | v57.15,26.67 57.33,26.6 | 57.15,26.18 56.97,26.6 | v57.15,26.67 56.97,26.6
FAULT  (via drill 0.33)
  Top 0.305: v41.91,39.37 41.91,38.88 | 41.91,38.88 | 41.91,38.88 LD3.A | 41.91,38.88 42.09,39.3 | 41.91,38.88 41.73,39.3 | 42.09,39.3 | 41.73,39.3 | v41.91,39.37 41.73,39.3 | 41.91,38.88 42.09,39.3 | 41.91,38.88 | 41.91,38.88 41.73,39.3 | 41.91,38.88 42.09,39.3 | v41.91,39.37 42.09,39.3 | 41.91,38.88 41.73,39.3 | v41.91,39.37 41.73,39.3 | 41.91,38.88 42.09,39.3 | v41.91,39.37 42.09,39.3 | 41.91,38.88 41.73,39.3 | v41.91,39.37 41.73,39.3
  Bottom 0.305: A1.19 40.01,30.21 | 40.01,30.21 | 40.01,30.21 40.01,37.2 arc-45 40.19,37.65 41.56,39.02 | 41.56,39.02 v41.91,39.37 | 41.56,39.02 41.98,39.19 v41.91,39.37 | 41.56,39.02 41.73,39.44 v41.91,39.37
  Bottom 0.61: 40.01,30.21 | 40.01,30.21 39.53,29.55 | 40.01,30.21 39.53,29.55 | 40.01,30.21 40.48,29.55 | A1.19 40.48,29.55 | 40.01,30.21 39.53,29.55 | A1.19 39.53,29.55 | 40.01,30.21 40.48,29.55 | 40.01,30.21 39.53,29.55 | A1.19 39.53,29.55 | 40.01,30.21 40.48,29.55 | A1.19 40.48,29.55 | 40.01,30.21 39.53,29.55 | A1.19 39.53,29.55 | 40.01,30.21 40.48,29.55 | A1.19 40.48,29.55
FB_5V
  Top 0.305: IC2.3 24.45,21.59 R22.1 R23.2
FB_24V
  Top 0.406: IC1.5 48.26,45.09 arc-90 48.68,44.66 C13.2 R17.1 R16.2
GND  (via drill 0.33)
  Top 0.305: v16.59,41.56 16.78,41.1 | 16.78,41.1 v17.14,40.22 | v16.59,38.87 15.7,38.5 | 15.7,38.5 v15.24,38.31 | v13.89,38.87 13.53,39.76 | 13.53,39.76 v13.34,40.22 | v13.34,40.22 13.53,40.67 | 13.53,40.67 v13.89,41.56 | 16.95,40.67 16.95,40.22 | 16.95,40.22 | 16.95,40.22 | 16.95,40.67 17.28,40.35 | 16.95,40.67 16.95,40.22 | v17.14,40.22 16.95,40.22 | 16.95,40.67 17.28,40.35 | v17.14,40.22 17.28,40.35 | 16.95,40.67 16.95,40.22 | v17.14,40.22 16.95,40.22 | 16.95,40.67 17.28,40.35 | v17.14,40.22 17.28,40.35 | 15.7,38.5 15.24,38.5 v15.24,38.31 | 15.7,38.5 15.38,38.18 v15.24,38.31 | 13.53,39.76 13.53,40.22 | v13.34,40.22 13.53,40.22 | 13.53,39.76 13.2,40.08 v13.34,40.22 | 13.53,40.67 13.2,40.35 v13.34,40.22 | 13.53,40.67 13.53,40.22 | v13.34,40.22 13.53,40.22 | 16.78,41.1 16.78,41.56 v16.59,41.56 | 16.78,41.1 16.45,41.43 v16.59,41.56 | 16.13,38.68 16.59,38.68 | 16.59,38.68 | 16.59,38.68 | 16.13,38.68 16.45,39 | 16.13,38.68 16.59,38.68 | v16.59,38.87 16.59,38.68 | 16.13,38.68 16.45,39 | v16.59,38.87 16.45,39 | 16.13,38.68 16.59,38.68 | v16.59,38.87 16.59,38.68 | 16.13,38.68 16.45,39 | v16.59,38.87 16.45,39 | 13.7,39.33 13.7,38.87 | 13.7,38.87 | 13.7,38.87 | 13.7,39.33 14.03,39 | 13.7,39.33 13.7,38.87 | v13.89,38.87 13.7,38.87 | 13.7,39.33 14.03,39 | v13.89,38.87 14.03,39 | 13.7,39.33 13.7,38.87 | v13.89,38.87 13.7,38.87 | 13.7,39.33 14.03,39 | v13.89,38.87 14.03,39 | 13.7,41.1 14.03,41.43 | 13.7,41.1 13.7,41.56 | v13.89,41.56 13.7,41.56 | 13.7,41.1 14.03,41.43 | v13.89,41.56 14.03,41.43 | 13.7,41.1 13.7,41.56 | v13.89,41.56 13.7,41.56 | 13.7,41.1 14.03,41.43 | v13.89,41.56 14.03,41.43 | 13.7,41.1 13.7,41.56 | v13.89,41.56 13.7,41.56
  Top 0.61: 46.99,47.62 45.4,47.62
  other vias: 60.96,24.13 55.24,17.46 73.66,36.2 73.66,34.92 73.66,33.66 77.47,33.66 77.47,34.92 77.47,36.2 95.57,48.9 95.57,46.99 89.53,51.44 95.57,22.23 95.57,24.13 89.53,26.67 9.53,57.47 11.43,57.47 13.97,57.47 37.78,52.7 35.88,52.7 33.97,52.7 32.07,52.7 73.66,11.43 73.66,10.16 73.66,8.89 48.9,47.62 23.18,41.27 23.18,38.42 26.35,38.42 26.35,41.27 36.83,39.69 39.05,39.69 43.5,44.13 45.4,44.13 45.4,49.85 43.5,49.85 44.13,41.27 44.13,54.29 6.35,49.85 2.86,25.08 2.86,30.8 2.86,13.02 16.83,13.02 13.02,5.71 53.34,17.46 57.15,17.46 53.02,44.77 56.2,44.77 59.37,44.77 58.1,33.34 65.72,44.77 68.26,49.21 68.26,46.67 71.12,58.24 71.12,56.52 71.12,60.01 73.66,58.24 43.81,39.69 51.75,42.23 34.29,39.69 25.4,22.86 20,19.68 20,23.81 27.3,11.43 28.57,11.43 43.5,14.29 45.4,14.29 25.08,11.11 23.18,11.11 21.27,11.11 19.37,11.11 92.08,2.54 97.79,7.62 91.44,10.16 17.46,16.83 15.56,16.83 15.24,42.12 51.12,40.01 9.21,2.54 55.24,42.23 57.78,42.23 60.33,42.23 26.04,20.32 56.2,24.13 62.23,17.78 64.77,18.1 66.04,24.13 64.14,10.16 64.14,12.38 49.85,19.05 49.85,16.19 39.37,11.75 46.35,10.79 34.92,27.3 44.13,26.04 41.59,24.77 3.49,38.73 8.57,29.53 6.99,30.48 7.94,13.34 10.79,12.7 31.43,11.43 36.2,13.97 56.83,11.43 56.83,15.24 52.39,56.52 23.18,50.48 26.35,50.48 19.68,32.07 2.54,53.02 92.39,59.37 55.56,6.67 52.39,6.67 20.95,6.35 88.9,6.03 77.47,11.43 77.47,10.16 77.47,8.89 62.55,44.77 71.12,49.21 73.66,49.21 75.56,49.21 78.74,49.21 89.53,46.35 83.19,38.73 82.87,13.97 86.36,6.03 23.18,40.01 26.35,40.01 11.43,32.07 11.43,33.97 29.84,35.24 45.4,35.56 51.12,30.48 50.04,23.01 32.07,23.81 32.07,16.83 40.32,16.83 70.8,43.5 78.42,39.69 78.42,14.92 73.98,27.3 85.41,23.18 85.41,25.08 85.72,47.94 85.72,49.85 70.8,39.05 52.07,49.21 73.66,60.01 73.66,56.52 73.98,29.84 73.98,28.57 70.48,36.2 72.39,24.13 70.48,6.03 90.17,13.65 96.52,14.29 90.17,38.42 92.71,38.42 95.25,38.42 87.63,54.29 97.79,54.29 66.67,56.2 92.71,27.3 18.41,26.67 64.14,14.61
  pour Top (rank 5): 0,62 arc0 100,62 100,0 0,0
  pour Bottom (rank 5): 0,0 100,0 100,62 0,62
  pour Bottom (rank 5): 11.68,40.22 arc-90 15.24,43.77 arc-90 18.8,40.22 arc-90 15.24,36.66 arc-90
  pour Top (rank 5): 11.68,40.22 arc-90 15.24,43.77 arc-90 18.8,40.22 arc-90 15.24,36.66 arc-90
I_SW1
  Top 0.305: IC4.1 91,50.7 arc-45 91.24,50.8 R29.2
I_SW1_MON  (via drill 0.33)
  Top 0.305: R29.1 94.19,50.23 arc-90 93.81,49.85 92.88,49.85 arc90 92.5,49.46 C16.1 91.94,48.9 | v91.44,48.9 91.94,48.9 | 91.94,48.9 | 91.94,48.9 91.51,49.07 | 91.94,48.9 91.51,48.72 | 91.51,49.07 | 91.51,48.72 | v91.44,48.9 91.51,48.72 | 91.94,48.9 91.51,49.07 | 91.94,48.9 | 91.94,48.9 91.51,48.72 | 91.94,48.9 91.51,49.07 | v91.44,48.9 91.51,49.07 | 91.94,48.9 91.51,48.72 | v91.44,48.9 91.51,48.72 | 91.94,48.9 91.51,49.07 | v91.44,48.9 91.51,49.07 | 91.94,48.9 91.51,48.72 | v91.44,48.9 91.51,48.72
  Bottom 0.305: A1.6 19.68,7.89 | 19.68,7.89 | 19.68,7.89 19.68,4.71 arc90 20.58,3.81 89.91,3.81 93.98,7.88 93.98,45.98 arc45 93.72,46.62 91.79,48.55 | 91.79,48.55 v91.44,48.9 | 91.79,48.55 91.62,48.97 v91.44,48.9 | 91.79,48.55 91.37,48.72 v91.44,48.9
  Bottom 0.61: 19.68,7.89 19.21,8.55 | 19.68,7.89 20.16,8.55 | A1.6 20.16,8.55 | 19.68,7.89 19.21,8.55 | 19.68,7.89 20.16,8.55 | A1.6 20.16,8.55 | 19.68,7.89 19.21,8.55 | A1.6 19.21,8.55 | 19.68,7.89 20.16,8.55 | 19.68,7.89 | 19.68,7.89 19.21,8.55 | A1.6 19.21,8.55 | 19.68,7.89 20.16,8.55 | A1.6 20.16,8.55 | 19.68,7.89 19.21,8.55 | A1.6 19.21,8.55
I_SW2
  Top 0.305: R30.2 91.24,26.04 arc45 91,25.93 IC5.1
I_SW2_MON  (via drill 0.33)
  Top 0.305: R30.1 94.19,25.47 arc-90 93.81,25.08 92.88,25.08 arc90 92.5,24.7 C18.1 91.94,24.13 | 91.94,24.13 | 91.94,24.13 v91.44,24.13 | 91.94,24.13 91.51,24.31 | 91.94,24.13 91.51,23.95 | 91.51,24.31 | 91.51,23.95 | v91.44,24.13 91.51,23.95 | 91.94,24.13 91.51,24.31 | 91.94,24.13 | 91.94,24.13 91.51,23.95 | 91.94,24.13 91.51,24.31 | v91.44,24.13 91.51,24.31 | 91.94,24.13 91.51,23.95 | v91.44,24.13 91.51,23.95 | 91.94,24.13 91.51,24.31 | v91.44,24.13 91.51,24.31 | 91.94,24.13 91.51,23.95 | v91.44,24.13 91.51,23.95
  Bottom 0.305: A1.7 22.23,7.89 | 22.23,7.89 | 22.23,7.89 22.23,5.98 arc90 23.12,5.08 89.44,5.08 92.71,8.36 92.71,22.6 arc45 92.52,23.05 91.79,23.78 | 91.79,23.78 v91.44,24.13 | 91.79,23.78 91.62,24.2 v91.44,24.13 | 91.79,23.78 91.37,23.95 v91.44,24.13
  Bottom 0.61: 22.23,7.89 21.75,8.55 | 22.23,7.89 22.7,8.55 | A1.7 22.7,8.55 | 22.23,7.89 21.75,8.55 | 22.23,7.89 22.7,8.55 | A1.7 22.7,8.55 | 22.23,7.89 21.75,8.55 | A1.7 21.75,8.55 | 22.23,7.89 22.7,8.55 | 22.23,7.89 | 22.23,7.89 21.75,8.55 | A1.7 21.75,8.55 | 22.23,7.89 22.7,8.55 | A1.7 22.7,8.55 | 22.23,7.89 21.75,8.55 | A1.7 21.75,8.55
N$1
  Top 0.406: SH4.1 R21.1
  pour Top (rank 3, no thermals): 84.45,14.92 79.51,14.92 arc-90 79.06,15.37 79.06,21.91 arc-90 79.38,22.23 85.72,22.23 arc-90 86.04,21.91 86.04,16.51 arc-90
N$2
  Top 0.305: Q1.1 32.07,39.88 arc-45 31.94,39.56 28.29,35.91 arc-45 27.96,35.77 R35.1
N$3
  Top 0.61: T1.4 R11.1
N$4
  Top 0.406: D5.A 77.53,38.44 arc-90 76.83,39.14 R1.1
  pour Top (rank 2, no thermals): 79.06,31.75 79.06,39.05 arc-90 79.38,39.37 81.92,39.37 81.92,38.1 arc90 82.23,37.78 84.7,37.78 arc-90 86.04,36.44 86.04,32.07 arc-90 85.72,31.75
N$6
  Top 0.406: R1.2 LD4.C
N$9
  Top 0.61: T2.4 R3.1
N$10
  Top 0.406: D7.A 77.53,13.68 arc-90 76.83,14.38 R20.1
  pour Top (rank 2, no thermals): 86.04,11.54 86.04,7.3 arc-90 85.72,6.99 79.38,6.99 arc-90 79.06,7.3 79.06,14.29 arc-90 79.38,14.61 81.92,14.61 81.92,13.34 arc90 82.23,13.02 84.56,13.02 arc-90
N$11
  Top 0.406: LD5.C R20.2
N$12
  Top 0.406: SH2.1 R2.1
  pour Top (rank 3, no thermals): 79.06,40.14 79.06,46.67 arc-90 79.38,46.99 85.72,46.99 arc-90 86.04,46.67 86.04,41.27 arc-90 84.45,39.69 79.51,39.69 arc-90
N$13
  Top 0.305: LD3.C 41.94,36.62 R25.2
N$14
  Top 0.305: LD1.C 48.9,36.52 R18.2
N$19
  Top 0.305: LD2.C 34.95,36.62 R24.2
RT_24V
  Top 0.305: IC1.4 40.64,45.09 39.24,43.68 arc45 39.05,43.23 R13.2
SBUS_IN
  Top 0.305: A1.14 40.01,9.89 | 40.01,9.89 | 40.01,9.89 40.01,10.53 arc-90 40.9,11.43 45.46,11.43 arc45 45.91,11.62 49.34,15.05 arc-45 49.79,15.24 IC6.4
  Top 0.61: 40.01,9.89 | 40.01,9.89 39.53,9.23 | 40.01,9.89 39.53,9.23 | 40.01,9.89 40.48,9.23 | A1.14 40.48,9.23 | 40.01,9.89 39.53,9.23 | A1.14 39.53,9.23 | 40.01,9.89 40.48,9.23 | 40.01,9.89 39.53,9.23 | A1.14 39.53,9.23 | 40.01,9.89 40.48,9.23 | A1.14 40.48,9.23 | 40.01,9.89 39.53,9.23 | A1.14 39.53,9.23 | 40.01,9.89 40.48,9.23 | A1.14 40.48,9.23
SS_24V
  Top 0.406: IC1.6 50.16,46.35 C14.1
SW1_EN  (via drill 0.33)
  Top 0.305: 29.84,30.21 29.84,32.12 arc-90 30.74,33.02 53.71,33.02 arc-45 54.16,32.83 55.06,31.94 arc-45 55.24,31.49 55.24,26.3 arc45 55.43,25.85 55.53,25.75 | 29.84,30.21 | 29.84,30.21 A1.23 | IC3.2 56.38,25.4 | 56.38,25.4 | 56.38,25.4 v55.88,25.4 | v55.88,25.4 55.53,25.75 | R31.1 55.24,21.09 | 55.24,21.09 | 55.24,21.09 v55.24,21.59 | 55.24,21.09 55.42,21.52 | 55.24,21.09 55.07,21.52 | 55.42,21.52 | 55.07,21.52 | v55.24,21.59 55.07,21.52 | 56.38,25.4 55.95,25.58 | 56.38,25.4 55.95,25.22 | 55.95,25.58 | 55.95,25.22 | v55.88,25.4 55.95,25.22 | 55.24,21.09 55.42,21.52 | 55.24,21.09 | 55.24,21.09 55.07,21.52 | 55.24,21.09 55.42,21.52 | v55.24,21.59 55.42,21.52 | 55.24,21.09 55.07,21.52 | v55.24,21.59 55.07,21.52 | 55.24,21.09 55.42,21.52 | v55.24,21.59 55.42,21.52 | 55.24,21.09 55.07,21.52 | v55.24,21.59 55.07,21.52 | 56.38,25.4 55.95,25.58 | 56.38,25.4 | 56.38,25.4 55.95,25.22 | 56.38,25.4 55.95,25.58 | v55.88,25.4 55.95,25.58 | 56.38,25.4 55.95,25.22 | v55.88,25.4 55.95,25.22 | 56.38,25.4 55.95,25.58 | v55.88,25.4 55.95,25.58 | 56.38,25.4 55.95,25.22 | v55.88,25.4 55.95,25.22 | 55.53,25.75 55.7,25.33 v55.88,25.4 | 55.53,25.75 55.95,25.58 | v55.88,25.4 55.95,25.58
  Top 0.61: 29.84,30.21 | 29.84,30.21 29.37,29.55 | 29.84,30.21 29.37,29.55 | 29.84,30.21 30.32,29.55 | A1.23 30.32,29.55 | 29.84,30.21 29.37,29.55 | A1.23 29.37,29.55 | 29.84,30.21 30.32,29.55 | 29.84,30.21 29.37,29.55 | A1.23 29.37,29.55 | 29.84,30.21 30.32,29.55 | A1.23 30.32,29.55 | 29.84,30.21 29.37,29.55 | A1.23 29.37,29.55 | 29.84,30.21 30.32,29.55 | A1.23 30.32,29.55
  Bottom 0.305: v55.24,21.59 55.24,22.09 | 55.24,22.09 | 55.24,22.09 55.24,24.5 arc-45 55.43,24.95 55.53,25.05 | 55.53,25.05 v55.88,25.4 | 55.24,22.09 55.07,21.66 | 55.07,21.66 | v55.24,21.59 55.07,21.66 | 55.24,22.09 55.42,21.66 | 55.24,22.09 55.07,21.66 | 55.24,22.09 | 55.24,22.09 55.07,21.66 | v55.24,21.59 55.07,21.66 | 55.24,22.09 55.42,21.66 | 55.42,21.66 | v55.24,21.59 55.42,21.66 | 55.24,22.09 55.07,21.66 | 55.24,22.09 55.42,21.66 | 55.24,22.09 55.07,21.66 | v55.24,21.59 55.07,21.66 | 55.24,22.09 55.42,21.66 | v55.24,21.59 55.42,21.66 | 55.53,25.05 55.95,25.22 v55.88,25.4 | 55.53,25.05 55.7,25.47 v55.88,25.4
SW1_GATE
  Top 0.406: R11.2 R12.1
  Top 0.61: IC3.7 67.31,25.4 arc90 70.49,28.58 R11.2
SW1_N
  Top 0.305: SH2.2 81.92,48.03 arc-90 82.55,48.67 88.27,48.67 arc-90 88.58,48.35 IC4.4
SW1_P
  Top 0.305: SH1.2 81.92,49.76 arc90 82.55,49.12 88.27,49.12 arc90 88.58,49.44 IC4.3
SW2_EN
  Top 0.305: 32.38,30.21 32.38,30.85 arc-90 33.28,31.75 52.44,31.75 arc-45 52.89,31.56 53.79,30.67 arc-45 53.98,30.22 53.98,23.76 arc45 54.16,23.31 54.61,22.86 | 32.38,30.21 | 32.38,30.21 A1.22 | 54.61,22.86 IC3.4 | R32.1 53.34,21.33 arc-45 53.53,21.78 54.61,22.86
  Top 0.61: 32.38,30.21 | 32.38,30.21 31.91,29.55 | 32.38,30.21 31.91,29.55 | 32.38,30.21 32.86,29.55 | A1.22 32.86,29.55 | 32.38,30.21 31.91,29.55 | A1.22 31.91,29.55 | 32.38,30.21 32.86,29.55 | 32.38,30.21 31.91,29.55 | A1.22 31.91,29.55 | 32.38,30.21 32.86,29.55 | A1.22 32.86,29.55 | 32.38,30.21 31.91,29.55 | A1.22 31.91,29.55 | 32.38,30.21 32.86,29.55 | A1.22 32.86,29.55
SW2_GATE
  Top 0.305: R3.2 R4.1
  Top 0.61: IC3.5 67.31,22.86 arc-90 70.49,19.68 R4.1
SW2_N
  Top 0.305: IC5.4 88.58,23.58 arc90 88.27,23.9 82.55,23.9 arc90 81.92,23.27 SH4.2
SW2_P
  Top 0.305: IC5.3 88.58,24.68 arc-90 88.27,24.36 82.55,24.36 arc-90 81.92,24.99 SH3.2
SW_5V
  pour Top (rank 2, no thermals): 29.21,24.13 27.94,24.13 arc90 27.62,23.81 27.62,20.39 arc-90 26.91,19.68 26.04,19.68 26.04,17.14 arc90 26.67,16.51 29.21,16.51 arc90 29.84,17.14 29.84,17.78 arc-90 30.48,18.41 33.02,18.41 33.02,22.23 30.48,22.23 arc-90 29.84,22.86 29.84,23.5 arc90
SW_24V  (via drill 0.33)
  Top 0.813: v39.69,52.07 39.69,50.59 C1.2
  Bottom 0.813: v39.69,52.07 v46.99,52.07
  pour Top (no thermals): 56.52,55.24 48.15,55.24 arc90 46.35,53.45 46.35,48.58 48.26,48.58 48.26,49.27 arc-90 49.16,50.16 56.52,50.16
V_USB
  Top 0.813: D13.C 23.5,26.04 arc-90 22.23,27.3 22.23,28.21 | 22.23,28.21 A1.26 | 22.23,28.21 22.65,28.98 A1.26 | 22.23,28.21 21.8,28.98 A1.26
VCC
  Top 0.406: R5.2 21.38,15.37 C7.1 | R6.2 19.71,56.09 arc-45 20.38,55.82 TP3.1 | 17.94,47.41 24.77,47.41 C24.+
  Top 0.61: C8.1 21.38,15.37 | TP3.1 C24.+
  Top 0.813: 17.94,47.41 16.93,48.72 X1.+ 16.93,46.11 17.94,47.41
  Top 1.422: X1.+ 12.54,47.41 | 12.54,47.41 10.66,47.41 arc45 9.45,46.91 6.39,43.85 arc45 5.71,42.23 5.71,35.51 arc45 6.13,34.51 9.74,30.9 arc-45 10.16,29.89 10.16,19.31 arc90 14.23,15.24 24.77,15.24 | 12.54,47.41 14,46.07 X1.+ | 12.54,47.41 14,48.76 X1.+
  Top 3.81: X1.+ 17.94,47.41 | 17.94,47.41 35.13,47.41 | 17.94,47.41 15.39,48.03 X1.+ | 17.94,47.41 15.39,46.8 X1.+
  pour Top (no thermals): 31.43,49.19 39.07,49.21 arc-45 39.58,49 40.55,48.04 arc45 40.77,47.94 42.55,47.94 42.55,47.31 40.76,47.31 arc41 40.55,47.23 38.94,45.82 arc-41 38.46,45.64 31.43,45.64
  pour Top (no thermals): 18.73,16.19 22.62,16.19 arc45 23.57,16.59 25.08,18.1 25.08,19.37 25.72,19.37 25.72,14.92 arc-90 25.4,14.61 18.41,14.61 18.41,15.88
VCC_MON
  Top 0.305: D1.C 8.92,53.49 arc-45 8.56,53.34 5.5,53.34 arc45 5.04,53.15 2.68,50.79 arc45 2.54,50.45 2.54,33.28 arc45 2.73,32.83 6.16,29.4 arc-45 6.35,28.95 6.35,13.6 arc45 6.54,13.15 8.07,11.62 arc45 8.52,11.43 16.25,11.43 arc-90 17.14,10.53 17.14,9.89 | A1.5 17.14,9.89 | 17.14,9.89
  Top 0.406: D1.C 9.82,54.4 R8.2 C4.1 R6.1
  Top 0.61: 17.14,9.89 | 17.14,9.89 16.67,9.23 | 17.14,9.89 16.67,9.23 | 17.14,9.89 17.62,9.23 | A1.5 17.62,9.23 | 17.14,9.89 16.67,9.23 | A1.5 16.67,9.23 | 17.14,9.89 17.62,9.23 | 17.14,9.89 16.67,9.23 | A1.5 16.67,9.23 | 17.14,9.89 17.62,9.23 | A1.5 17.62,9.23 | 17.14,9.89 16.67,9.23 | A1.5 16.67,9.23 | 17.14,9.89 17.62,9.23 | A1.5 17.62,9.23

## Text on the board
tPlace: Bonk Switch | Rev 1. | +VCC | FAULT | +24V | 26-51V input | Designed by / @pinski1_ | Designed for Nelly / Battlebots 2020
bPlace: It's Bonking / Time
tNames: SW1 | +5V0 | SW2